# Altium schematic sheet circuit_2023-05-02.schdoc
size 383 x 254 mm
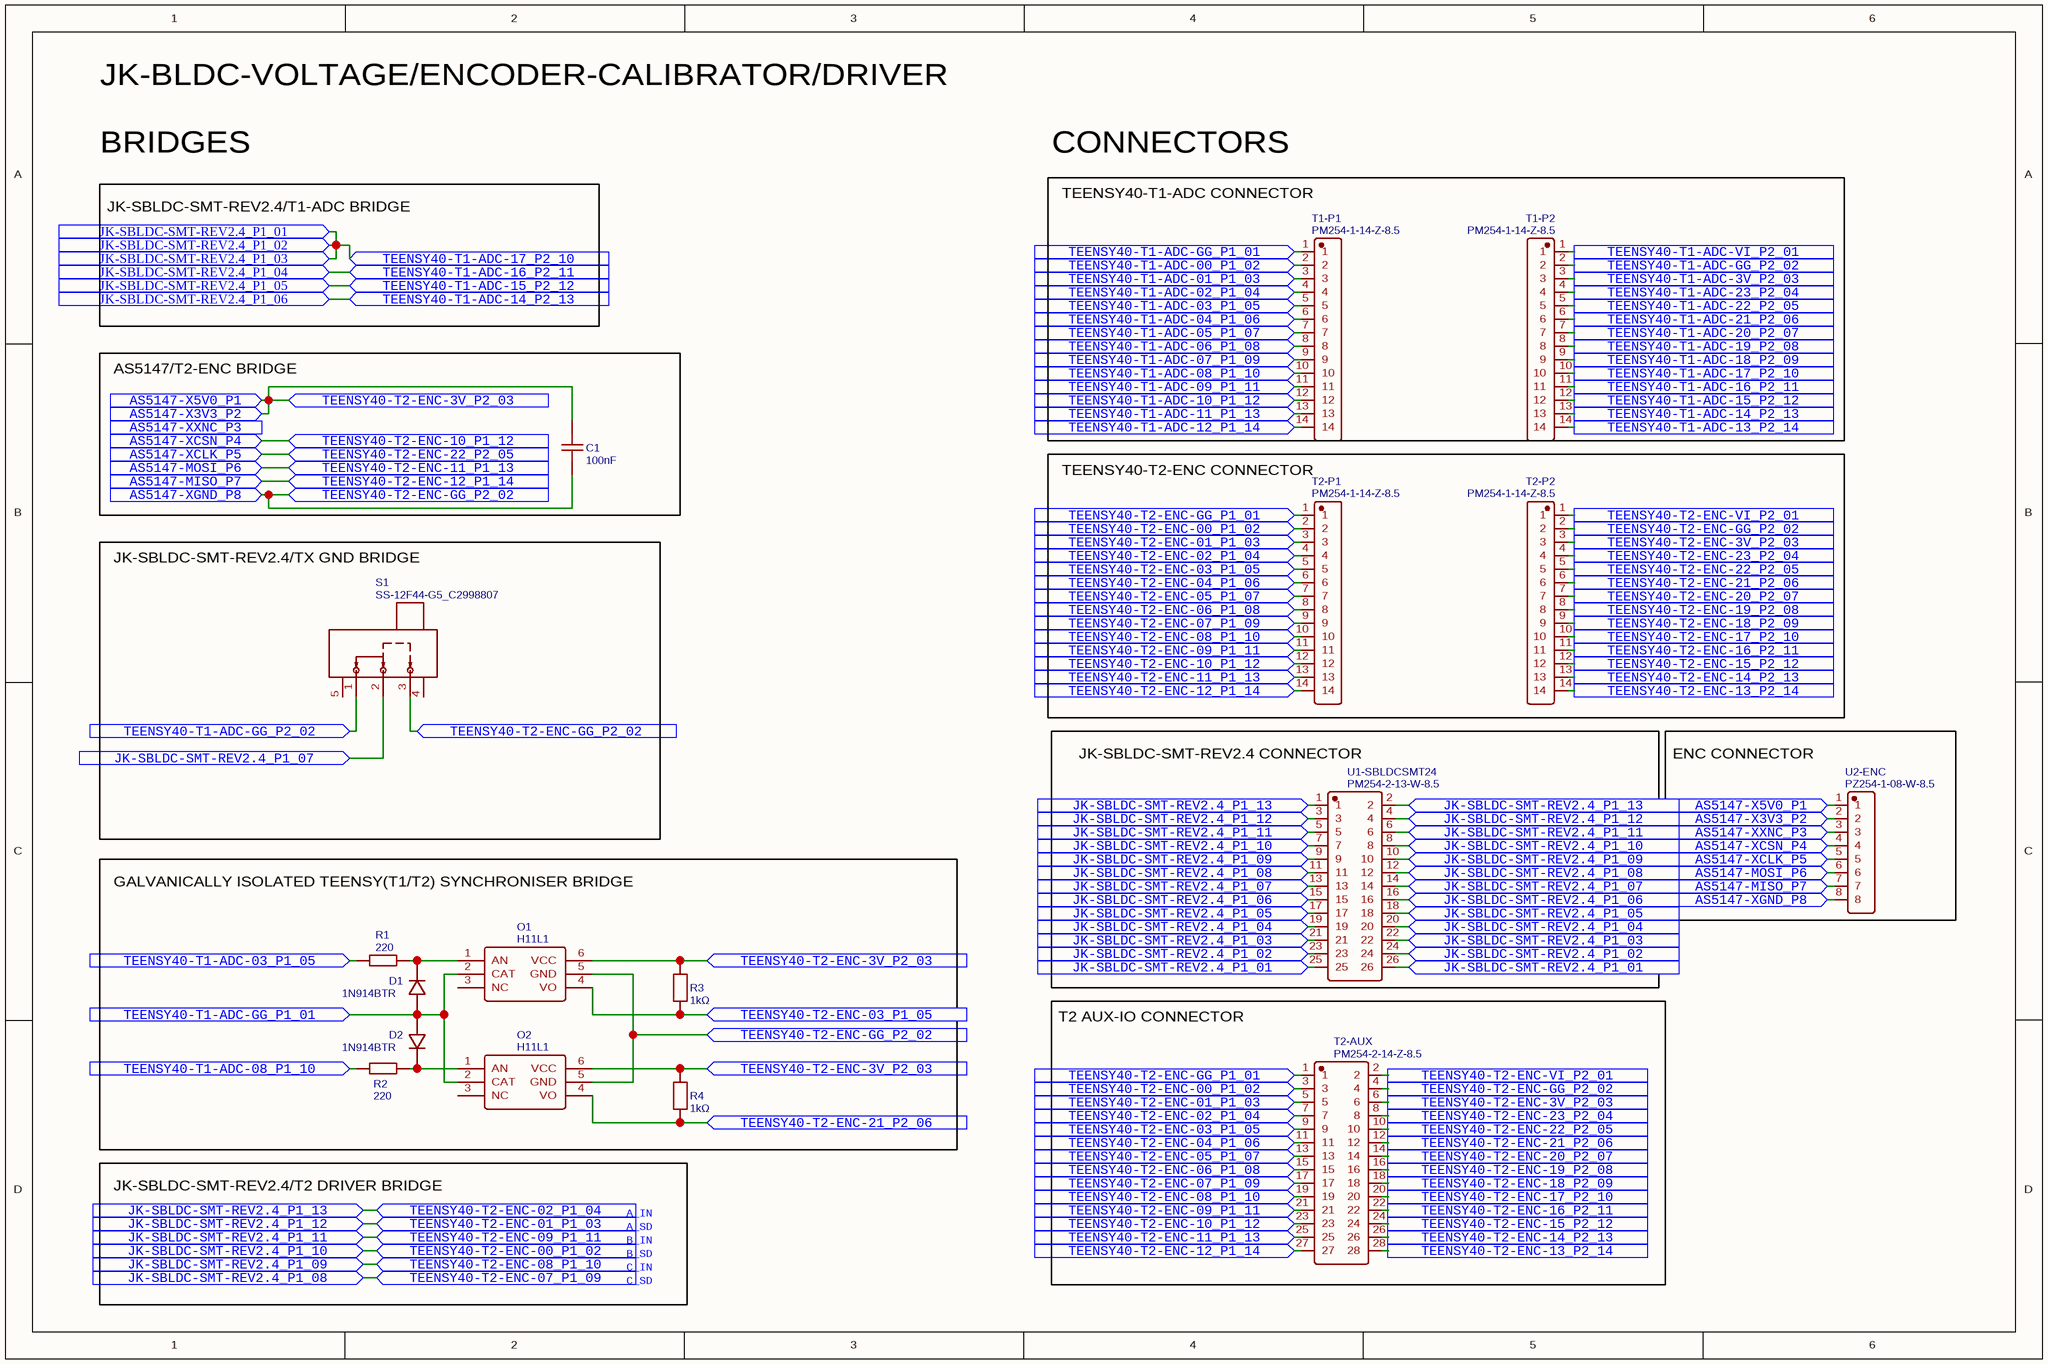
[diagram p0: circuit_2023-05-02.schdoc]

## Parts
C1  100nF  [CAP-TH_L5.0-W2.5-P5.08-D0.7]
D1  1N914BTR  [DO-35_BD2.0-L4.2-P8.20-D0.5-RD]
D2  1N914BTR  [DO-35_BD2.0-L4.2-P8.20-D0.5-RD]
O1  H11L1  [DIP-6_L8.5-W6.4-P2.54-LS7.6-BL]
O2  H11L1  [DIP-6_L8.5-W6.4-P2.54-LS7.6-BL]
R1  220  [RES-TH_BD2.4-L6.3-P10.30-D0.6]
R2  220  [RES-TH_BD2.4-L6.3-P10.30-D0.6]
R3  1kΩ  [RES-TH_BD2.3-L6.5-P10.50-D0.5]
R4  1kΩ  [RES-TH_BD2.3-L6.5-P10.50-D0.5]
S1  SS-12F44-G5_C2998807  [SW-TH_SS-12F44-G5_C2998807]
T1-P1  PM254-1-14-Z-8.5  [HDR-TH_14P-P2.54-V-F-1]
T1-P2  PM254-1-14-Z-8.5  [HDR-TH_14P-P2.54-V-F-1]
T2-AUX  PM254-2-14-Z-8.5  [HDR-TH_28P-P2.54-V-F-R2-C14-S2.54-1]
T2-P1  PM254-1-14-Z-8.5  [HDR-TH_14P-P2.54-V-F-1]
T2-P2  PM254-1-14-Z-8.5  [HDR-TH_14P-P2.54-V-F-1]
U1-SBLDCSMT24  PM254-2-13-W-8.5  [HDR-TH_26P-P2.54-H-F-R2-C13-W8.5]
U2-ENC  PZ254-1-08-W-8.5  [HDR-TH_08P-P2.54-H-M-W10.4-N]

## Blocks framed on the sheet
CONNECTORS: T1-P1 T1-P2
AS5147/T2-ENC BRIDGE: C1
TEENSY40-T2-ENC CONNECTOR: T2-P1 T2-P2
JK-SBLDC-SMT-REV2.4/TX GND BRIDGE: S1
JK-SBLDC-SMT-REV2.4 CONNECTOR: U1-SBLDCSMT24
ENC CONNECTOR: U2-ENC
GALVANICALLY ISOLATED TEENSY(T1/T2) SYNCHRONISER BRIDGE: D1 D2 O1 O2 R1-R4
T2 AUX-IO CONNECTOR: T2-AUX

## Ports
AS5147-MISO_P7 (in), AS5147-MOSI_P6 (in), AS5147-X3V3_P2 (in), AS5147-X5V0_P1 (in), AS5147-XCLK_P5 (in), AS5147-XCSN_P4 (in), AS5147-XGND_P8 (in), AS5147-XXNC_P3 (in), JK-SBLDC-SMT-REV2.4_P1_01 (in), JK-SBLDC-SMT-REV2.4_P1_02 (in), JK-SBLDC-SMT-REV2.4_P1_03 (in), JK-SBLDC-SMT-REV2.4_P1_04 (in), JK-SBLDC-SMT-REV2.4_P1_05 (in), JK-SBLDC-SMT-REV2.4_P1_06 (in), JK-SBLDC-SMT-REV2.4_P1_07 (in), JK-SBLDC-SMT-REV2.4_P1_08 (in), JK-SBLDC-SMT-REV2.4_P1_09 (in), JK-SBLDC-SMT-REV2.4_P1_10 (in), JK-SBLDC-SMT-REV2.4_P1_11 (in), JK-SBLDC-SMT-REV2.4_P1_12 (in), JK-SBLDC-SMT-REV2.4_P1_13 (in), TEENSY40-T1-ADC-00_P1_02 (in), TEENSY40-T1-ADC-01_P1_03 (in), TEENSY40-T1-ADC-02_P1_04 (in), TEENSY40-T1-ADC-03_P1_05 (in), TEENSY40-T1-ADC-3V_P2_03 (in), TEENSY40-T1-ADC-04_P1_06 (in), TEENSY40-T1-ADC-05_P1_07 (in), TEENSY40-T1-ADC-06_P1_08 (in), TEENSY40-T1-ADC-07_P1_09 (in), TEENSY40-T1-ADC-08_P1_10 (in), TEENSY40-T1-ADC-09_P1_11 (in), TEENSY40-T1-ADC-10_P1_12 (in), TEENSY40-T1-ADC-11_P1_13 (in), TEENSY40-T1-ADC-12_P1_14 (in), TEENSY40-T1-ADC-13_P2_14 (in), TEENSY40-T1-ADC-14_P2_13 (in), TEENSY40-T1-ADC-15_P2_12 (in), TEENSY40-T1-ADC-16_P2_11 (in), TEENSY40-T1-ADC-17_P2_10 (in), TEENSY40-T1-ADC-18_P2_09 (in), TEENSY40-T1-ADC-19_P2_08 (in), TEENSY40-T1-ADC-20_P2_07 (in), TEENSY40-T1-ADC-21_P2_06 (in), TEENSY40-T1-ADC-22_P2_05 (in), TEENSY40-T1-ADC-23_P2_04 (in), TEENSY40-T1-ADC-GG_P1_01 (in), TEENSY40-T1-ADC-GG_P2_02 (in), TEENSY40-T1-ADC-VI_P2_01 (in), TEENSY40-T2-ENC-00_P1_02 (in), TEENSY40-T2-ENC-01_P1_03 (in), TEENSY40-T2-ENC-02_P1_04 (in), TEENSY40-T2-ENC-03_P1_05 (in), TEENSY40-T2-ENC-3V_P2_03 (in), TEENSY40-T2-ENC-04_P1_06 (in), TEENSY40-T2-ENC-05_P1_07 (in), TEENSY40-T2-ENC-06_P1_08 (in), TEENSY40-T2-ENC-07_P1_09 (in), TEENSY40-T2-ENC-08_P1_10 (in), TEENSY40-T2-ENC-09_P1_11 (in), TEENSY40-T2-ENC-10_P1_12 (in), TEENSY40-T2-ENC-11_P1_13 (in), TEENSY40-T2-ENC-12_P1_14 (in), TEENSY40-T2-ENC-13_P2_14 (in), TEENSY40-T2-ENC-14_P2_13 (in), TEENSY40-T2-ENC-15_P2_12 (in), TEENSY40-T2-ENC-16_P2_11 (in), TEENSY40-T2-ENC-17_P2_10 (in), TEENSY40-T2-ENC-18_P2_09 (in), TEENSY40-T2-ENC-19_P2_08 (in), TEENSY40-T2-ENC-20_P2_07 (in), TEENSY40-T2-ENC-21_P2_06 (in), TEENSY40-T2-ENC-22_P2_05 (in), TEENSY40-T2-ENC-23_P2_04 (in), TEENSY40-T2-ENC-GG_P1_01 (in), TEENSY40-T2-ENC-GG_P2_02 (in), TEENSY40-T2-ENC-VI_P2_01 (in)

## Nets
AS5147-MISO_P7: T2-AUX.27 T2-P1.14 U2-ENC.7 ; port TEENSY40-T2-ENC-12_P1_14, port AS5147-MISO_P7
AS5147-MOSI_P6: T2-AUX.25 T2-P1.13 U2-ENC.6 ; port TEENSY40-T2-ENC-11_P1_13, port AS5147-MOSI_P6
AS5147-X3V3_P2: C1.1 O1.6(VCC) O2.6(VCC) R3.1 R4.1 T2-AUX.6 T2-P2.3 U2-ENC.1 U2-ENC.2 ; port TEENSY40-T2-ENC-3V_P2_03, port AS5147-X5V0_P1, port AS5147-X3V3_P2
AS5147-XCLK_P5: T2-AUX.10 T2-P2.5 U2-ENC.5 ; port TEENSY40-T2-ENC-22_P2_05, port AS5147-XCLK_P5
AS5147-XCSN_P4: T2-AUX.23 T2-P1.12 U2-ENC.4 ; port TEENSY40-T2-ENC-10_P1_12, port AS5147-XCSN_P4
AS5147-XGND_P8: C1.2 O1.5(GND) O2.5(GND) S1.3 T2-AUX.4 T2-P2.2 U2-ENC.8 ; port TEENSY40-T2-ENC-GG_P2_02, port AS5147-XGND_P8
AS5147-XXNC_P3: U2-ENC.3 ; port AS5147-XXNC_P3
JK-SBLDC-SMT-REV2.4_P1_01: T1-P2.10 U1-SBLDCSMT24.21 U1-SBLDCSMT24.22 U1-SBLDCSMT24.23 U1-SBLDCSMT24.24 U1-SBLDCSMT24.25 U1-SBLDCSMT24.26 ; port JK-SBLDC-SMT-REV2.4_P1_03, port JK-SBLDC-SMT-REV2.4_P1_02, port JK-SBLDC-SMT-REV2.4_P1_01, port TEENSY40-T1-ADC-17_P2_10
JK-SBLDC-SMT-REV2.4_P1_04: T1-P2.11 U1-SBLDCSMT24.19 U1-SBLDCSMT24.20 ; port JK-SBLDC-SMT-REV2.4_P1_04, port TEENSY40-T1-ADC-16_P2_11
JK-SBLDC-SMT-REV2.4_P1_05: T1-P2.12 U1-SBLDCSMT24.17 U1-SBLDCSMT24.18 ; port JK-SBLDC-SMT-REV2.4_P1_05, port TEENSY40-T1-ADC-15_P2_12
JK-SBLDC-SMT-REV2.4_P1_06: T1-P2.13 U1-SBLDCSMT24.15 U1-SBLDCSMT24.16 ; port JK-SBLDC-SMT-REV2.4_P1_06, port TEENSY40-T1-ADC-14_P2_13
JK-SBLDC-SMT-REV2.4_P1_07: S1.2 U1-SBLDCSMT24.13 U1-SBLDCSMT24.14 ; port JK-SBLDC-SMT-REV2.4_P1_07
JK-SBLDC-SMT-REV2.4_P1_08: T2-AUX.17 T2-P1.9 U1-SBLDCSMT24.11 U1-SBLDCSMT24.12 ; port JK-SBLDC-SMT-REV2.4_P1_08, port TEENSY40-T2-ENC-07_P1_09
JK-SBLDC-SMT-REV2.4_P1_09: T2-AUX.19 T2-P1.10 U1-SBLDCSMT24.9 U1-SBLDCSMT24.10 ; port JK-SBLDC-SMT-REV2.4_P1_09, port TEENSY40-T2-ENC-08_P1_10
JK-SBLDC-SMT-REV2.4_P1_10: T2-AUX.3 T2-P1.2 U1-SBLDCSMT24.7 U1-SBLDCSMT24.8 ; port JK-SBLDC-SMT-REV2.4_P1_10, port TEENSY40-T2-ENC-00_P1_02
JK-SBLDC-SMT-REV2.4_P1_11: T2-AUX.21 T2-P1.11 U1-SBLDCSMT24.5 U1-SBLDCSMT24.6 ; port JK-SBLDC-SMT-REV2.4_P1_11, port TEENSY40-T2-ENC-09_P1_11
JK-SBLDC-SMT-REV2.4_P1_12: T2-AUX.5 T2-P1.3 U1-SBLDCSMT24.3 U1-SBLDCSMT24.4 ; port JK-SBLDC-SMT-REV2.4_P1_12, port TEENSY40-T2-ENC-01_P1_03
JK-SBLDC-SMT-REV2.4_P1_13: T2-AUX.7 T2-P1.4 U1-SBLDCSMT24.1 U1-SBLDCSMT24.2 ; port JK-SBLDC-SMT-REV2.4_P1_13, port TEENSY40-T2-ENC-02_P1_04
TEENSY40-T1-ADC-00_P1_02: T1-P1.2 ; port TEENSY40-T1-ADC-00_P1_02
TEENSY40-T1-ADC-01_P1_03: T1-P1.3 ; port TEENSY40-T1-ADC-01_P1_03
TEENSY40-T1-ADC-02_P1_04: T1-P1.4 ; port TEENSY40-T1-ADC-02_P1_04
TEENSY40-T1-ADC-03_P1_05: R1.1 T1-P1.5 ; port TEENSY40-T1-ADC-03_P1_05
TEENSY40-T1-ADC-3V_P2_03: T1-P2.3 ; port TEENSY40-T1-ADC-3V_P2_03
TEENSY40-T1-ADC-04_P1_06: T1-P1.6 ; port TEENSY40-T1-ADC-04_P1_06
TEENSY40-T1-ADC-05_P1_07: T1-P1.7 ; port TEENSY40-T1-ADC-05_P1_07
TEENSY40-T1-ADC-06_P1_08: T1-P1.8 ; port TEENSY40-T1-ADC-06_P1_08
TEENSY40-T1-ADC-07_P1_09: T1-P1.9 ; port TEENSY40-T1-ADC-07_P1_09
TEENSY40-T1-ADC-08_P1_10: R2.1 T1-P1.10 ; port TEENSY40-T1-ADC-08_P1_10
TEENSY40-T1-ADC-09_P1_11: T1-P1.11 ; port TEENSY40-T1-ADC-09_P1_11
TEENSY40-T1-ADC-10_P1_12: T1-P1.12 ; port TEENSY40-T1-ADC-10_P1_12
TEENSY40-T1-ADC-11_P1_13: T1-P1.13 ; port TEENSY40-T1-ADC-11_P1_13
TEENSY40-T1-ADC-12_P1_14: T1-P1.14 ; port TEENSY40-T1-ADC-12_P1_14
TEENSY40-T1-ADC-13_P2_14: T1-P2.14 ; port TEENSY40-T1-ADC-13_P2_14
TEENSY40-T1-ADC-18_P2_09: T1-P2.9 ; port TEENSY40-T1-ADC-18_P2_09
TEENSY40-T1-ADC-19_P2_08: T1-P2.8 ; port TEENSY40-T1-ADC-19_P2_08
TEENSY40-T1-ADC-20_P2_07: T1-P2.7 ; port TEENSY40-T1-ADC-20_P2_07
TEENSY40-T1-ADC-21_P2_06: T1-P2.6 ; port TEENSY40-T1-ADC-21_P2_06
TEENSY40-T1-ADC-22_P2_05: T1-P2.5 ; port TEENSY40-T1-ADC-22_P2_05
TEENSY40-T1-ADC-23_P2_04: T1-P2.4 ; port TEENSY40-T1-ADC-23_P2_04
TEENSY40-T1-ADC-GG_P1_01: D1.2 D2.2 O1.2(CAT) O2.2(CAT) T1-P1.1 ; port TEENSY40-T1-ADC-GG_P1_01
TEENSY40-T1-ADC-GG_P2_02: S1.1 T1-P2.2 ; port TEENSY40-T1-ADC-GG_P2_02
TEENSY40-T1-ADC-VI_P2_01: T1-P2.1 ; port TEENSY40-T1-ADC-VI_P2_01
TEENSY40-T2-ENC-03_P1_05: O1.4(VO) R3.2 T2-AUX.9 T2-P1.5 ; port TEENSY40-T2-ENC-03_P1_05
TEENSY40-T2-ENC-04_P1_06: T2-AUX.11 T2-P1.6 ; port TEENSY40-T2-ENC-04_P1_06
TEENSY40-T2-ENC-05_P1_07: T2-AUX.13 T2-P1.7 ; port TEENSY40-T2-ENC-05_P1_07
TEENSY40-T2-ENC-06_P1_08: T2-AUX.15 T2-P1.8 ; port TEENSY40-T2-ENC-06_P1_08
TEENSY40-T2-ENC-13_P2_14: T2-AUX.28 T2-P2.14 ; port TEENSY40-T2-ENC-13_P2_14
TEENSY40-T2-ENC-14_P2_13: T2-AUX.26 T2-P2.13 ; port TEENSY40-T2-ENC-14_P2_13
TEENSY40-T2-ENC-15_P2_12: T2-AUX.24 T2-P2.12 ; port TEENSY40-T2-ENC-15_P2_12
TEENSY40-T2-ENC-16_P2_11: T2-AUX.22 T2-P2.11 ; port TEENSY40-T2-ENC-16_P2_11
TEENSY40-T2-ENC-17_P2_10: T2-AUX.20 T2-P2.10 ; port TEENSY40-T2-ENC-17_P2_10
TEENSY40-T2-ENC-18_P2_09: T2-AUX.18 T2-P2.9 ; port TEENSY40-T2-ENC-18_P2_09
TEENSY40-T2-ENC-19_P2_08: T2-AUX.16 T2-P2.8 ; port TEENSY40-T2-ENC-19_P2_08
TEENSY40-T2-ENC-20_P2_07: T2-AUX.14 T2-P2.7 ; port TEENSY40-T2-ENC-20_P2_07
TEENSY40-T2-ENC-21_P2_06: O2.4(VO) R4.2 T2-AUX.12 T2-P2.6 ; port TEENSY40-T2-ENC-21_P2_06
TEENSY40-T2-ENC-23_P2_04: T2-AUX.8 T2-P2.4 ; port TEENSY40-T2-ENC-23_P2_04
TEENSY40-T2-ENC-GG_P1_01: T2-AUX.1 T2-P1.1 ; port TEENSY40-T2-ENC-GG_P1_01
TEENSY40-T2-ENC-VI_P2_01: T2-AUX.2 T2-P2.1 ; port TEENSY40-T2-ENC-VI_P2_01
NetD1_1: D1.1 O1.1(AN) R1.2
NetD2_1: D2.1 O2.1(AN) R2.2

Not connected (* = marked no-connect by the designer): O1 3(NC); O2 3(NC); S1 4 5

## Notes on the sheet
- JK-BLDC-VOLTAGE/ENCODER-CALIBRATOR/DRIVER
- BRIDGES
- JK-SBLDC-SMT-REV2.4/T1-ADC BRIDGE
- TEENSY40-T1-ADC CONNECTOR
- JK-SBLDC-SMT-REV2.4/T2 DRIVER BRIDGE
- B_IN
- A_SD
- A_IN
- C_SD
- C_IN
- B_SD

## Library data of the parts
C1 = 100nF: BOM_Manufacturer: Dersonic(德尔创); BOM_Manufacturer Part: CC2A104ZC1ID3F7C30MF; nameAlias: Capacitance; Contributor: LCSC; BOM_Supplier: LCSC; BOM_Supplier Part: C254109; BOM_JLCPCB Part Class: Extended Part; spicePre: C; spiceSymbolName: CC2A104ZC1ID3F7C30MF
D1 D2 = 1N914BTR: BOM_Manufacturer: onsemi(安森美); Contributor: LCSC; BOM_Supplier: LCSC; BOM_Supplier Part: C258180; BOM_Manufacturer Part: 1N914BTR; BOM_JLCPCB Part Class: Extended Part; spicePre: D; spiceSymbolName: 1N914BTR
O1 O2 = H11L1: BOM_Manufacturer: EVERLIGHT(亿光); BOM_Supplier: LCSC; BOM_Manufacturer Part: H11L1; BOM_Supplier Part: C78588; BOM_JLCPCB Part Class: Extended Part; spicePre: U; spiceSymbolName: H11L1
R1 R2 = 220: BOM_Manufacturer: YAGEO(国巨); BOM_Manufacturer Part: MFR-25FTE52-220R; nameAlias: Resistance (Ohms); Contributor: LCSC; Resistance: 220Ω; BOM_Supplier: LCSC; BOM_Supplier Part: C172985; BOM_JLCPCB Part Class: Extended Part; spicePre: R; spiceSymbolName: MFR-25FTE52-220R
R3 R4 = 1kΩ: BOM_Manufacturer: Huaxing Mechanical-Elec.; BOM_Manufacturer Part: MF1/4W-1KΩ±1%T52; nameAlias: Resistance (Ohms); Contributor: LCSC; BOM_Supplier: LCSC; BOM_Supplier Part: C713997; BOM_JLCPCB Part Class: Extended Part; Resistance: 1kΩ; spicePre: R; spiceSymbolName: MF1/4W-1KΩ±1%T52
S1 = SS-12F44-G5_C2998807: BOM_Manufacturer: DEALON(德艺隆); Contributor: lcsc; BOM_Supplier: LCSC; BOM_Supplier Part: C2998807; BOM_Manufacturer Part: SS-12F44-G5; link: https://atta.szlcsc.com/upload/public/pdf/source/20220428/590A0165C728230C4E39516860AD3726.pdf; BOM_JLCPCB Part Class: Extended Part; spicePre: U; spiceSymbolName: SS-12F44-G5_C2998807
T1-P1 T1-P2 T2-P1 T2-P2 = PM254-1-14-Z-8.5: BOM_Manufacturer: HCTL(华灿天禄); Contributor: LCSC; BOM_Supplier: LCSC; BOM_Supplier Part: C2897377; BOM_Manufacturer Part: PM254-1-14-Z-8.5; BOM_JLCPCB Part Class: Extended Part; spicePre: U; spiceSymbolName: PM254-1-14-Z-8.5
T2-AUX = PM254-2-14-Z-8.5: BOM_Manufacturer: HCTL(华灿天禄); Contributor: LCSC; BOM_Supplier: LCSC; BOM_Supplier Part: C2897415; BOM_Manufacturer Part: PM254-2-14-Z-8.5; BOM_JLCPCB Part Class: Extended Part; spicePre: U; spiceSymbolName: PM254-2-14-Z-8.5
U1-SBLDCSMT24 = PM254-2-13-W-8.5: BOM_Manufacturer: HCTL(华灿天禄); Contributor: LCSC; BOM_Supplier: LCSC; BOM_Supplier Part: C2897433; BOM_Manufacturer Part: PM254-2-13-W-8.5; BOM_JLCPCB Part Class: Extended Part; spicePre: U; spiceSymbolName: PM254-2-13-W-8.5
U2-ENC = PZ254-1-08-W-8.5: BOM_Manufacturer: HCTL(华灿天禄); Contributor: LCSC; BOM_Supplier: LCSC; BOM_Supplier Part: C2894950; BOM_Manufacturer Part: PZ254-1-08-W-8.5; BOM_JLCPCB Part Class: Extended Part; spicePre: H; spiceSymbolName: PZ254-1-08-W-8.5